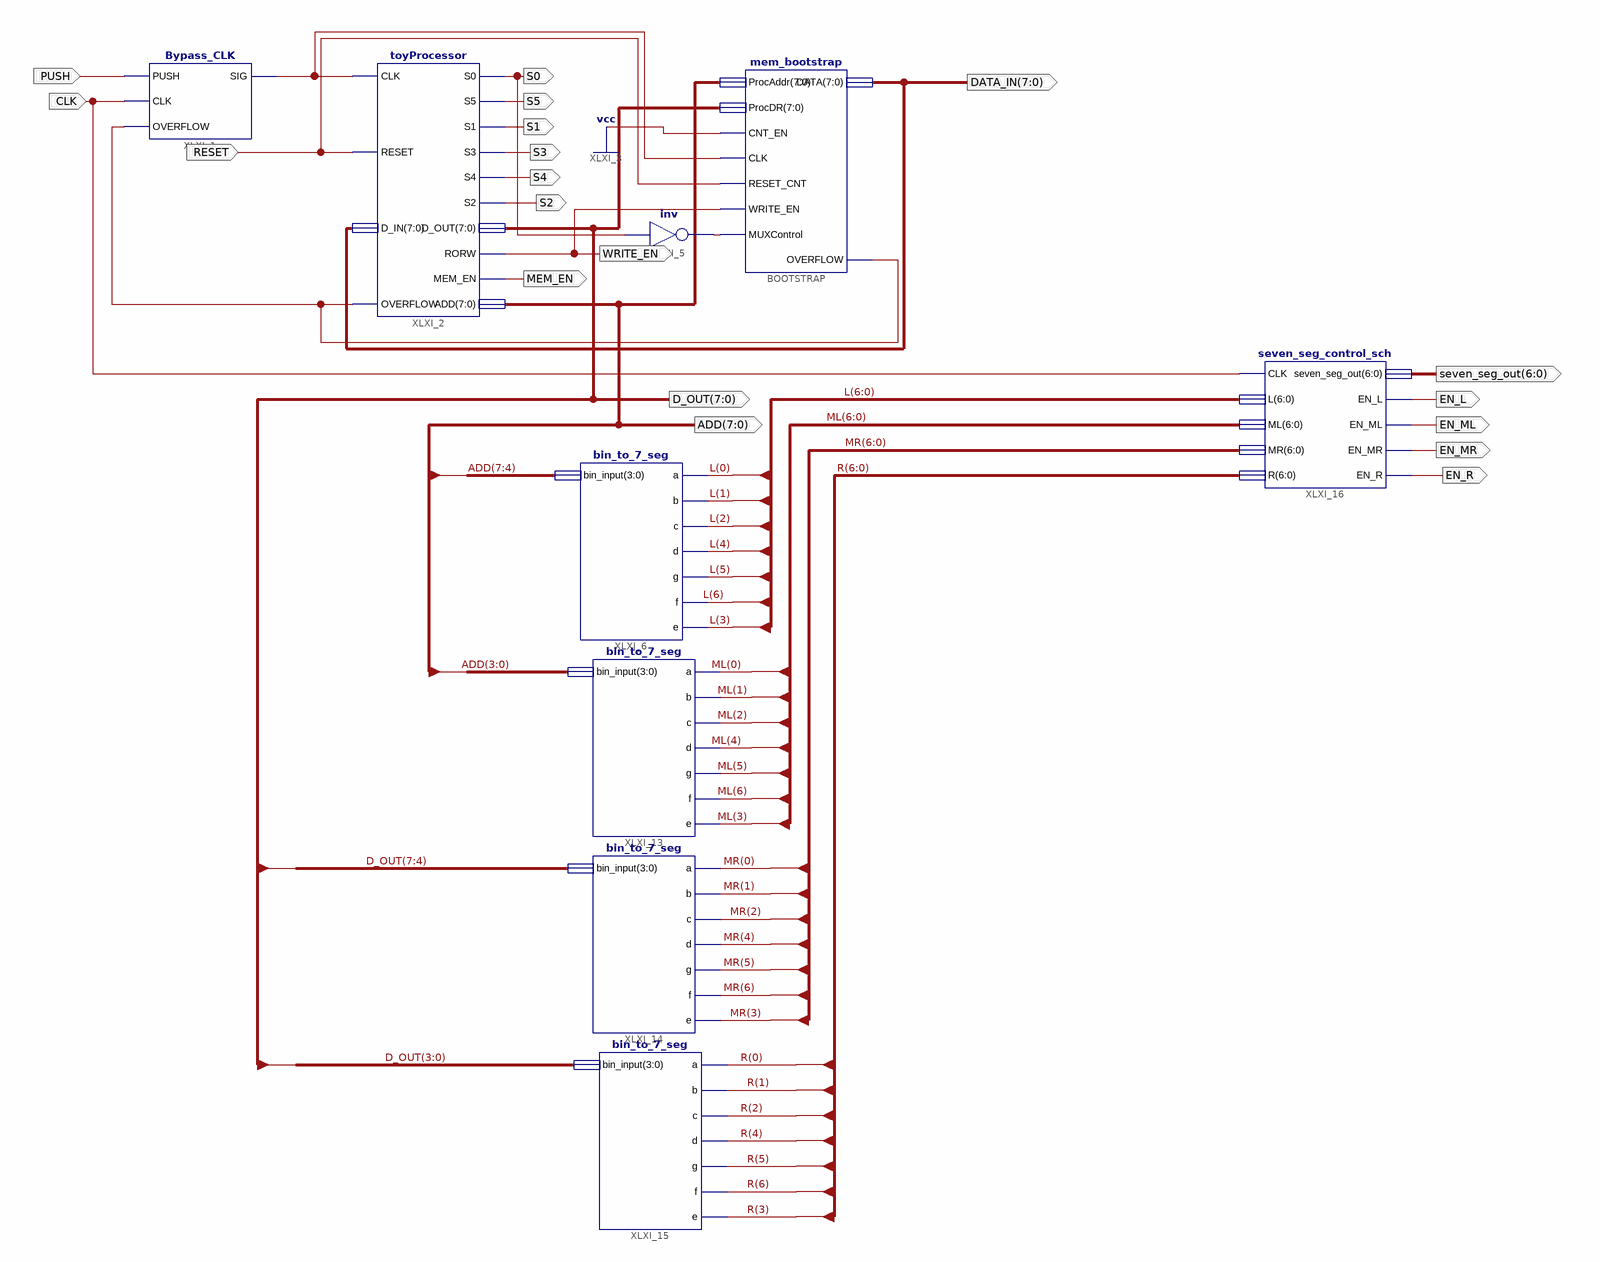
[diagram p0: schematic sheet 1]
// Xilinx ISE schematic FINAL_SCHEMATIC.sch (spartan3e) as structural Verilog: 9 symbols, 19 ports
module FINAL_SCHEMATIC (
  input  RESET,
  input  CLK,
  input  PUSH,
  output S0,
  output S5,
  output S1,
  output S3,
  output S4,
  output S2,
  output [7:0] D_OUT,
  output [7:0] DATA_IN,
  output WRITE_EN,
  output MEM_EN,
  output EN_L,
  output [6:0] seven_seg_out,
  output EN_ML,
  output EN_MR,
  output EN_R,
  output [7:0] ADD
);

  wire SIG, XLXN_19, XLXN_93;
  wire [6:0] L, ML, MR, R;

  toyProcessor XLXI_2 (
    .CLK(SIG), .RESET(RESET), .D_IN(DATA_IN), .OVERFLOW(XLXN_93), .S0(S0), .S5(S5), .S1(S1), .S3(S3),
    .S4(S4), .S2(S2), .D_OUT(D_OUT), .RORW(WRITE_EN), .MEM_EN(MEM_EN), .ADD(ADD));
  Bypass_CLK XLXI_1 (.PUSH(PUSH), .CLK(CLK), .OVERFLOW(XLXN_93), .SIG(SIG));
  not XLXI_5 (XLXN_19, S0);
  bin_to_7_seg XLXI_6 (.bin_input(ADD[7:4]), .a(L[0]), .b(L[1]), .c(L[2]), .d(L[4]), .g(L[5]), .f(L[6]), .e(L[3]));
  bin_to_7_seg XLXI_13 (
    .bin_input(ADD[3:0]), .a(ML[0]), .b(ML[1]), .c(ML[2]), .d(ML[4]), .g(ML[5]), .f(ML[6]), .e(ML[3]));
  bin_to_7_seg XLXI_14 (
    .bin_input(D_OUT[7:4]), .a(MR[0]), .b(MR[1]), .c(MR[2]), .d(MR[4]), .g(MR[5]), .f(MR[6]), .e(MR[3]));
  bin_to_7_seg XLXI_15 (.bin_input(D_OUT[3:0]), .a(R[0]), .b(R[1]), .c(R[2]), .d(R[4]), .g(R[5]), .f(R[6]), .e(R[3]));
  seven_seg_control_sch XLXI_16 (
    .CLK(CLK), .L(L), .ML(ML), .MR(MR), .R(R), .EN_MR(EN_MR), .EN_L(EN_L), .EN_ML(EN_ML), .EN_R(EN_R),
    .seven_seg_out(seven_seg_out));
  mem_bootstrap BOOTSTRAP (
    .ProcAddr(ADD), .ProcDR(D_OUT), .CNT_EN(1'b1), .CLK(SIG), .RESET_CNT(RESET), .WRITE_EN(WRITE_EN),
    .MUXControl(XLXN_19), .DATA(DATA_IN), .OVERFLOW(XLXN_93));
endmodule
